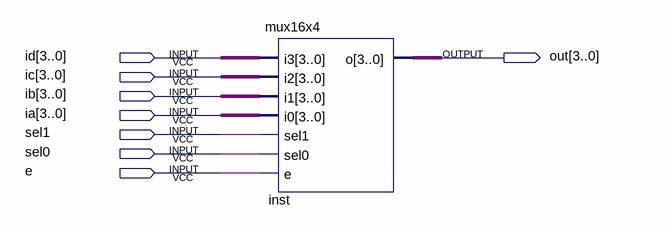
[diagram p0: schematic sheet]
// Quartus schematic Testemux16x4.bdf as structural Verilog: 1 symbols, 8 pins
module Testemux16x4 (
  input  [3:0] id,
  input  [3:0] ic,
  input  [3:0] ib,
  input  [3:0] ia,
  input  sel1,
  input  sel0,
  input  e,
  output [3:0] out
);

  mux16x4 inst (.sel1(sel1), .sel0(sel0), .i3(id), .i2(ic), .i1(ib), .i0(ia), .e(e), .o(out));
endmodule
